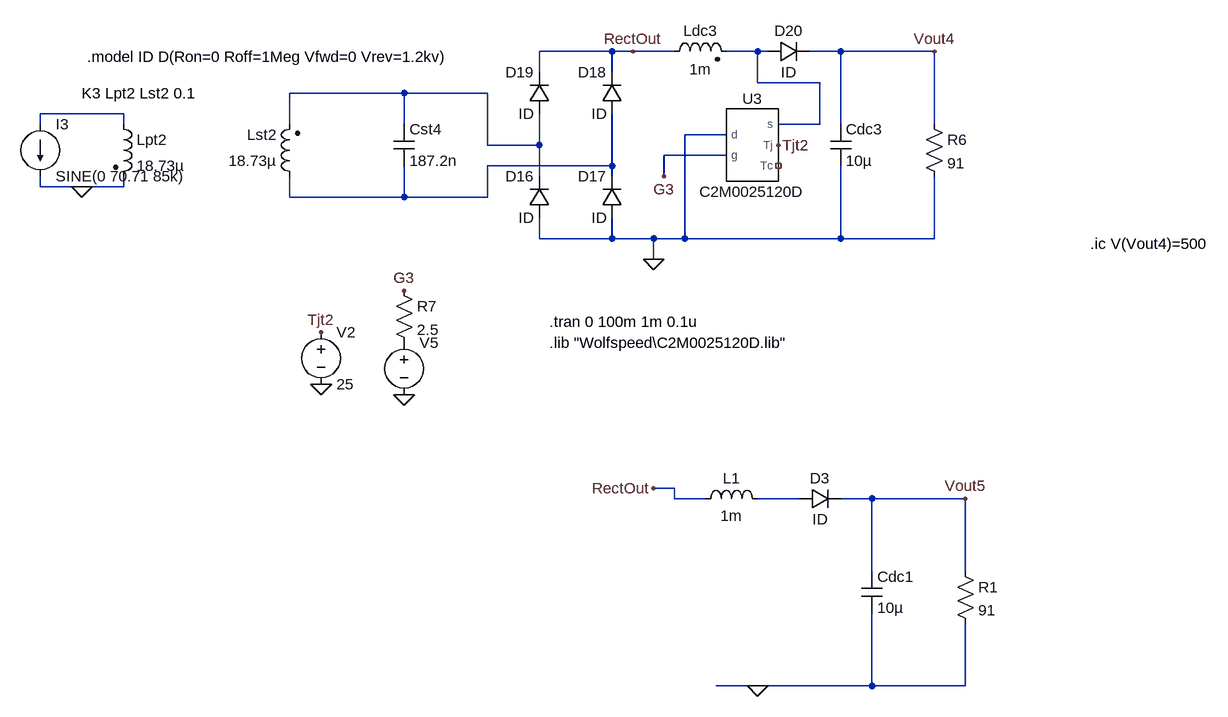
[diagram p0: schematic ShortCctRegLatest.asc]
ShortCctRegLatest.asc, the LTspice schematic file:
Version 4
SHEET 1 6276 4384
WIRE 2592 1104 2480 1104
WIRE 2624 1104 2592 1104
WIRE 2688 1104 2624 1104
WIRE 2816 1104 2768 1104
WIRE 2832 1104 2816 1104
WIRE 2944 1104 2896 1104
WIRE 3088 1104 2944 1104
WIRE 2480 1136 2480 1104
WIRE 2592 1136 2592 1104
WIRE 2816 1152 2816 1104
WIRE 2912 1152 2816 1152
WIRE 2272 1168 2096 1168
WIRE 2400 1168 2272 1168
WIRE 1840 1200 1712 1200
WIRE 1712 1216 1712 1200
WIRE 1840 1216 1840 1200
WIRE 2096 1216 2096 1168
WIRE 2272 1216 2272 1168
WIRE 2912 1216 2912 1152
WIRE 2912 1216 2848 1216
WIRE 2944 1216 2944 1104
WIRE 3088 1216 3088 1104
WIRE 2768 1232 2704 1232
WIRE 2400 1248 2400 1168
WIRE 2480 1248 2480 1200
WIRE 2480 1248 2400 1248
WIRE 2768 1264 2672 1264
WIRE 2592 1280 2592 1200
WIRE 2592 1280 2400 1280
WIRE 2480 1296 2480 1248
WIRE 2592 1296 2592 1280
WIRE 2672 1296 2672 1264
WIRE 1712 1312 1712 1296
WIRE 1776 1312 1712 1312
WIRE 1840 1312 1840 1296
WIRE 1840 1312 1776 1312
WIRE 2096 1328 2096 1296
WIRE 2272 1328 2272 1280
WIRE 2272 1328 2096 1328
WIRE 2400 1328 2400 1280
WIRE 2400 1328 2272 1328
WIRE 2480 1392 2480 1360
WIRE 2592 1392 2592 1360
WIRE 2592 1392 2480 1392
WIRE 2656 1392 2592 1392
WIRE 2704 1392 2704 1232
WIRE 2704 1392 2656 1392
WIRE 2944 1392 2944 1280
WIRE 2944 1392 2704 1392
WIRE 3088 1392 3088 1296
WIRE 3088 1392 2944 1392
WIRE 2656 1424 2656 1392
WIRE 2688 1776 2656 1776
WIRE 2688 1792 2688 1776
WIRE 2736 1792 2688 1792
WIRE 2880 1792 2816 1792
WIRE 2992 1792 2944 1792
WIRE 3136 1792 2992 1792
WIRE 2992 1904 2992 1792
WIRE 3136 1904 3136 1792
WIRE 2816 2080 2752 2080
WIRE 2992 2080 2992 1968
WIRE 2992 2080 2816 2080
WIRE 3136 2080 3136 1984
WIRE 3136 2080 2992 2080
FLAG 2144 1616 0
FLAG 2144 1536 Tjt2
FLAG 2656 1424 0
FLAG 3088 1104 Vout4
FLAG 2272 1632 0
FLAG 2272 1472 G3
FLAG 1776 1312 0
FLAG 2672 1296 G3
FLAG 2848 1248 Tjt2
FLAG 3136 1792 Vout5
FLAG 2656 1776 RectOut
FLAG 2624 1104 RectOut
FLAG 2816 2080 0
SYMBOL voltage 2144 1520 R0
WINDOW 123 0 0 Left 0
WINDOW 39 0 0 Left 0
SYMATTR InstName V2
SYMATTR Value 25
SYMBOL cap 2256 1216 R0
SYMATTR InstName Cst4
SYMATTR Value 187.2n
SYMBOL diode 2496 1360 R180
WINDOW 0 24 64 Left 2
WINDOW 3 24 0 Left 2
SYMATTR InstName D16
SYMATTR Value ID
SYMBOL diode 2608 1360 R180
WINDOW 0 24 64 Left 2
WINDOW 3 24 0 Left 2
SYMATTR InstName D17
SYMATTR Value ID
SYMBOL diode 2608 1200 R180
WINDOW 0 24 64 Left 2
WINDOW 3 24 0 Left 2
SYMATTR InstName D18
SYMATTR Value ID
SYMBOL diode 2496 1200 R180
WINDOW 0 24 64 Left 2
WINDOW 3 24 0 Left 2
SYMATTR InstName D19
SYMATTR Value ID
SYMBOL cap 2928 1216 R0
SYMATTR InstName Cdc3
SYMATTR Value 10µ
SYMBOL res 3072 1200 R0
SYMATTR InstName R6
SYMATTR Value 91
SYMBOL ind2 2672 1120 R270
WINDOW 0 32 56 VTop 2
WINDOW 3 4 56 VBottom 2
SYMATTR InstName Ldc3
SYMATTR Value 1m
SYMBOL diode 2832 1120 R270
WINDOW 0 32 32 VTop 2
WINDOW 3 0 32 VBottom 2
SYMATTR InstName D20
SYMATTR Value ID
SYMBOL current 1712 1216 R0
WINDOW 123 0 0 Left 0
WINDOW 39 0 0 Left 0
SYMATTR InstName I3
SYMATTR Value SINE(0 70.71 85k)
SYMBOL ind2 1824 1200 R0
SYMATTR InstName Lpt2
SYMATTR Value 18.73µ
SYMATTR Type ind
SYMBOL ind2 2112 1312 R180
WINDOW 0 36 80 Left 2
WINDOW 3 36 40 Left 2
SYMATTR InstName Lst2
SYMATTR Value 18.73µ
SYMATTR Type ind
SYMBOL voltage 2272 1536 R0
WINDOW 3 24 96 Invisible 2
WINDOW 123 0 0 Left 0
WINDOW 39 0 0 Left 0
SYMATTR Value PULSE(0 10 0 0 0 1u 10u)
SYMATTR InstName V5
SYMBOL res 2256 1456 R0
SYMATTR InstName R7
SYMATTR Value 2.5
SYMBOL C2M0025120D 2800 1248 R0
SYMATTR InstName U3
SYMBOL cap 2976 1904 R0
SYMATTR InstName Cdc1
SYMATTR Value 10µ
SYMBOL res 3120 1888 R0
SYMATTR InstName R1
SYMATTR Value 91
SYMBOL diode 2880 1808 R270
WINDOW 0 32 32 VTop 2
WINDOW 3 0 32 VBottom 2
SYMATTR InstName D3
SYMATTR Value ID
SYMBOL ind 2720 1808 R270
WINDOW 0 32 56 VTop 2
WINDOW 3 5 56 VBottom 2
SYMATTR InstName L1
SYMATTR Value 1m
TEXT 1784 1112 Left 2 !.model ID D(Ron=0 Roff=1Meg Vfwd=0 Vrev=1.2kv)
TEXT 2496 1552 Left 2 !.lib "Wolfspeed\\C2M0025120D.lib"
TEXT 3328 1400 Left 2 !.ic V(Vout4)=500
TEXT 1776 1168 Left 2 !K3 Lpt2 Lst2 0.1
TEXT 2496 1520 Left 2 !.tran 0 100m 1m 0.1u

The netlist it stands for:
* ShortCctRegLatest.asc
V2 Tjt2 0 25
Cst4 N002 N004 187.2n
D16 0 N002 ID
D17 0 N004 ID
D18 N004 RectOut ID
D19 N002 RectOut ID
Cdc3 Vout4 0 10µ
R6 Vout4 0 91
Ldc3 RectOut N001 1m
D20 N001 Vout4 ID
I3 N003 0 SINE(0 70.71 85k)
Lpt2 N003 0 18.73µ
Lst2 N004 N002 18.73µ
V5 P001 0 PULSE(0 10 0 0 0 1u 10u)
R7 G3 P001 2.5
XU3 0 G3 N001 Tjt2 NC_01 C2M0025120D  ; pins d g s Tj Tc
Cdc1 Vout5 0 10µ
R1 Vout5 0 91
D3 N005 Vout5 ID
L1 RectOut N005 1m
.model D D
.lib standard.dio
.model ID D(Ron=0 Roff=1Meg Vfwd=0 Vrev=1.2kv)
.lib "Wolfspeed\C2M0025120D.lib"
.ic V(Vout4)=500
K3 Lpt2 Lst2 0.1
.tran 0 100m 1m 0.1u
.lib C:\Users\Manoj\Documents\GitHub\2020-srw-rc-car\SecondaryConverter\all_ltspice_device_models\all_sic_mosfet_ltspice_models\C2M0025120D.lib
.backanno
.end